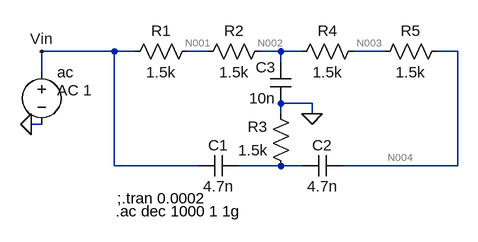
[diagram p0: schematic punto1.asc]
punto1.asc, the LTspice schematic file:
Version 4
SHEET 1 880 680
WIRE -16 64 -128 64
WIRE 16 64 -16 64
WIRE 128 64 96 64
WIRE 240 64 208 64
WIRE 272 64 240 64
WIRE 400 64 352 64
WIRE 512 64 480 64
WIRE 240 80 240 64
WIRE -128 96 -128 64
WIRE 288 144 240 144
WIRE 240 160 240 144
WIRE 288 160 288 144
WIRE -128 176 -144 176
WIRE -16 240 -16 64
WIRE 112 240 -16 240
WIRE 240 240 176 240
WIRE 272 240 240 240
WIRE 512 240 512 64
WIRE 512 240 336 240
FLAG 288 160 0
FLAG -144 176 0
FLAG -128 64 Vin
SYMBOL res 368 48 R90
WINDOW 0 0 56 VBottom 2
WINDOW 3 32 56 VTop 2
SYMATTR InstName R4
SYMATTR Value 1.5k
SYMATTR SpiceLine tol=5
SYMBOL res 256 256 R180
WINDOW 0 36 76 Left 2
WINDOW 3 36 40 Left 2
SYMATTR InstName R3
SYMATTR Value 1.5k
SYMATTR SpiceLine tol=5
SYMBOL cap 176 224 R90
WINDOW 0 0 32 VBottom 2
WINDOW 3 32 32 VTop 2
SYMATTR InstName C1
SYMATTR Value 4.7n
SYMBOL cap 336 224 R90
WINDOW 0 0 32 VBottom 2
WINDOW 3 32 32 VTop 2
SYMATTR InstName C2
SYMATTR Value 4.7n
SYMBOL cap 256 144 R180
WINDOW 0 24 56 Left 2
WINDOW 3 24 8 Left 2
SYMATTR InstName C3
SYMATTR Value 10n
SYMBOL res 224 48 R90
WINDOW 0 0 56 VBottom 2
WINDOW 3 32 56 VTop 2
SYMATTR InstName R2
SYMATTR Value 1.5k
SYMATTR SpiceLine tol=5
SYMBOL voltage -128 80 R0
WINDOW 3 24 44 Left 2
WINDOW 123 24 44 Left 2
WINDOW 39 0 0 Left 0
SYMATTR InstName ac
SYMATTR Value ""
SYMATTR Value2 AC 1
SYMBOL res 496 48 R90
WINDOW 0 0 56 VBottom 2
WINDOW 3 32 56 VTop 2
SYMATTR InstName R5
SYMATTR Value 1.5k
SYMATTR SpiceLine tol=5
SYMBOL res 112 48 R90
WINDOW 0 0 56 VBottom 2
WINDOW 3 32 56 VTop 2
SYMATTR InstName R1
SYMATTR Value 1.5k
SYMATTR SpiceLine tol=5
TEXT -12 290 Left 2 !;.tran 0.0002
TEXT -14 310 Left 2 !.ac dec 1000 1 1g

The netlist it stands for:
* punto1.asc
R4 N003 N002 1.5k tol=5
R3 N005 0 1.5k tol=5
C1 N005 Vin 4.7n
C2 N004 N005 4.7n
C3 0 N002 10n
R2 N002 N001 1.5k tol=5
V§ac Vin 0 AC 1
R5 N004 N003 1.5k tol=5
R1 N001 Vin 1.5k tol=5
;.tran 0.0002
.ac dec 1000 1 1g
.backanno
.end

* Results of the author's LTspice run, read from the files saved beside the schematic
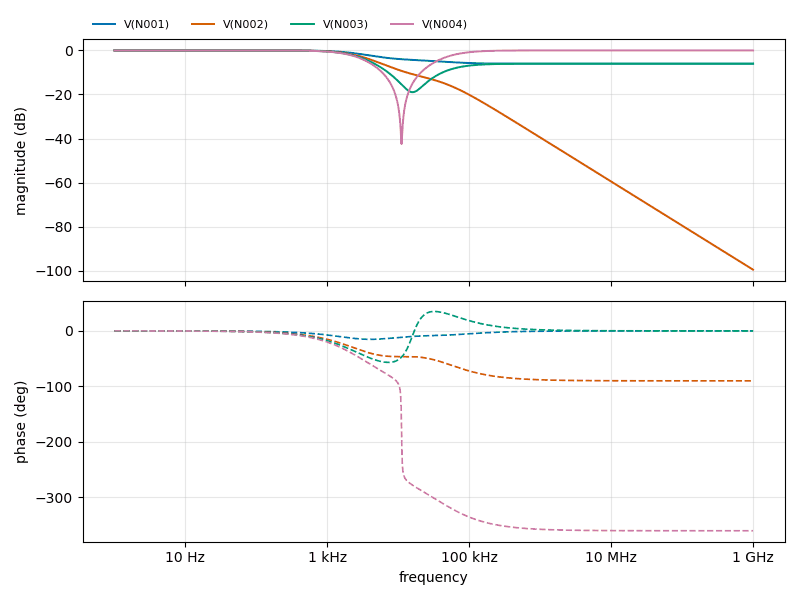
[diagram p1: AC Analysis of punto1.asc, plotted from the saved traces]
* AC Analysis, 1 run:
*   V(N001): -0.00 dB at 1 Hz, -6.02 dB at 1 GHz, peak -0.00 dB at 1 Hz, 3 dB below the peak at 5.586 kHz
*   V(N002): -0.00 dB at 1 Hz, -99.49 dB at 1 GHz, peak -0.00 dB at 1 Hz, 3 dB below the peak at 3.139 kHz
*   V(N003): -0.00 dB at 1 Hz, -6.02 dB at 1 GHz, peak -0.00 dB at 1 Hz, 3 dB below the peak at 2.789 kHz
*   V(N004): -0.00 dB at 1 Hz, -0.00 dB at 1 GHz, peak -0.00 dB at 1 GHz, 3 dB below the peak at 47.41 kHz